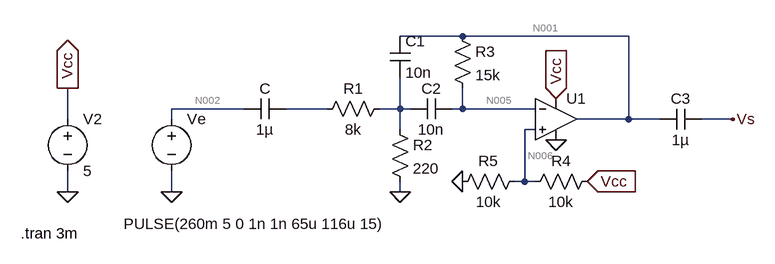
[diagram p0: schematic Cellule_Rauch.asc]
Cellule_Rauch.asc, the LTspice schematic file:
Version 4
SHEET 1 880 680
WIRE 288 80 192 80
WIRE 544 80 288 80
WIRE -48 192 -160 192
WIRE 80 192 16 192
WIRE 192 192 192 144
WIRE 192 192 160 192
WIRE 208 192 192 192
WIRE 288 192 288 160
WIRE 288 192 272 192
WIRE 400 192 288 192
WIRE -320 208 -320 160
WIRE -160 208 -160 192
WIRE 544 208 544 80
WIRE 544 208 464 208
WIRE 592 208 544 208
WIRE 704 208 656 208
WIRE 192 224 192 192
WIRE 400 224 384 224
WIRE 384 304 384 224
WIRE 384 304 368 304
WIRE 400 304 384 304
WIRE -320 320 -320 288
WIRE -160 320 -160 288
WIRE 192 320 192 304
FLAG -320 320 0
FLAG -320 160 Vcc
IOPIN -320 160 Out
FLAG -160 320 0
FLAG 288 304 0
FLAG 480 304 Vcc
IOPIN 480 304 In
FLAG 432 240 0
FLAG 432 176 Vcc
IOPIN 432 176 In
FLAG 192 320 0
FLAG 704 208 Vs
SYMBOL Opamps\\UniversalOpamp2 432 208 R0
SYMATTR InstName U1
SYMBOL voltage -160 192 R0
WINDOW 123 24 124 Left 2
WINDOW 39 0 0 Left 2
WINDOW 3 -74 177 Left 2
SYMATTR InstName Ve
SYMATTR Value PULSE(260m 5 0 1n 1n 65u 116u 15)
SYMBOL voltage -320 192 R0
SYMATTR InstName V2
SYMATTR Value 5
SYMBOL cap 16 176 R90
WINDOW 0 0 32 VBottom 2
WINDOW 3 32 32 VTop 2
SYMATTR InstName C
SYMATTR Value 1µ
SYMBOL res 176 208 R0
SYMATTR InstName R2
SYMATTR Value 220
SYMBOL res 176 176 R90
WINDOW 0 0 56 VBottom 2
WINDOW 3 32 56 VTop 2
SYMATTR InstName R1
SYMATTR Value 8k
SYMBOL cap 176 80 R0
SYMATTR InstName C1
SYMATTR Value 10n
SYMBOL cap 272 176 R90
WINDOW 0 0 32 VBottom 2
WINDOW 3 32 32 VTop 2
SYMATTR InstName C2
SYMATTR Value 10n
SYMBOL res 272 64 R0
SYMATTR InstName R3
SYMATTR Value 15k
SYMBOL res 496 288 R90
WINDOW 0 0 56 VBottom 2
WINDOW 3 32 56 VTop 2
SYMATTR InstName R4
SYMATTR Value 10k
SYMBOL res 384 288 R90
WINDOW 0 0 56 VBottom 2
WINDOW 3 32 56 VTop 2
SYMATTR InstName R5
SYMATTR Value 10k
SYMBOL cap 656 192 R90
WINDOW 0 0 32 VBottom 2
WINDOW 3 32 32 VTop 2
SYMATTR InstName C3
SYMATTR Value 1µ
TEXT -392 384 Left 2 !.tran 3m

The netlist it stands for:
* Cellule_Rauch.asc
XU1 N006 N005 Vcc 0 N001 level.2 Avol=1Meg GBW=10Meg Slew=10Meg ilimit=25m rail=0 Vos=0 phimargin=45 en=0 enk=0 in=0 ink=0 Rin=500Meg  ; pins IN+ IN- V+ V- OUT
Ve N002 0 PULSE(260m 5 0 1n 1n 65u 116u 15)
V2 Vcc 0 5
C N003 N002 1µ
R2 N004 0 220
R1 N004 N003 8k
C1 N001 N004 10n
C2 N005 N004 10n
R3 N001 N005 15k
R4 Vcc N006 10k
R5 N006 0 10k
C3 Vs N001 1µ
.tran 3m
.lib UniversalOpamps2.sub
.backanno
.end

* Results of the author's LTspice run, read from the files saved beside the schematic
* Operating Point, zero values left out:
*   V(n001) = 2.5 V
*   V(vcc) = 5 V
*   V(n005) = 2.5 V
*   V(n006) = 2.5 V
*   V(n002) = 260 mV
*   V(vs) = 2.5 µV
*   I(R5) = 250 µA
*   I(R4) = 250 µA
*   I(V2) = -500 µA
*   Ix(u1:3) = 250 µA
*   Ix(u1:4) = -250 µA
*   Ix(u1:5) = 198.3 pA